# Altium project Module_Power_3V3Buck.PrjPcb
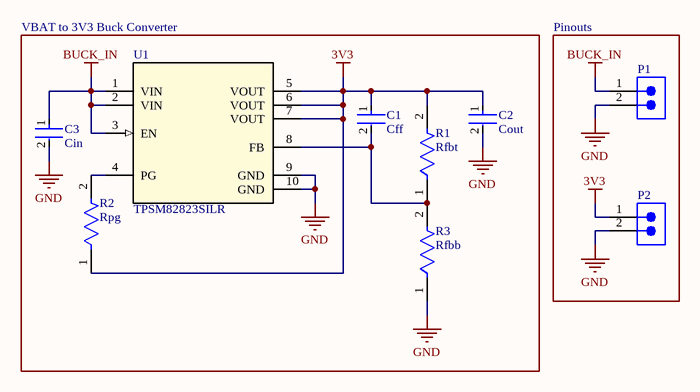
[diagram p0: Schematic.SchDoc]
1 sheet, 9 parts. Net scope: global (net labels, ports and power ports of the same name join across sheets).
Board file: PCB.PcbDoc

## Sheet Schematic.SchDoc
size A; SheetNumber: 1; SheetTotal: 1

### Parts
C1  Cff  [FP-GRM033-0_03-IPC_A]
C2  Cout  [FP-C0805C-DG-MFG]
C3  Cin  [FP-GRM188-0_1-e0_2_0_55-IPC_A]
P1  61300211121  [61300211121]  (value not drawn)
P2  61300211121  [61300211121]  (value not drawn)
R1  Rfbt  [FP-CRCW0402-e3-MFG]
R2  Rpg  [FP-CRCW0402-e3-IPC_C]
R3  Rfbb  [FP-CRCW0402-e3-IPC_C]
U1  TPSM82823SILR  [SIL0010D-MFG]

### Blocks framed on the sheet
VBAT to 3V3 Buck Converter: C1-C3 R1-R3 U1
Pinouts: P1 P2

### Nets
3V3: C1.1 C2.1 P2.1 R1.2 R2.1 U1.5(VOUT) U1.6(VOUT) U1.7(VOUT)
BUCK_IN: C3.1 P1.1 U1.1(VIN) U1.2(VIN) U1.3(EN)
GND: C2.2 C3.2 P1.2 P2.2 R3.1 U1.9(GND) U1.10(GND)
NetC1_2: C1.2 R1.1 R3.2 U1.8(FB)
NetR2_2: R2.2 U1.4(PG)

### Library data of the parts
C1 = CMP-2010-01296-2: Chip Multilayer Ceramic Capacitors for General Purpose, 0201, 120pF, X7R, 15%, 10%, 25V; Thickness: 0.013inch; Packaging: Tape and Reel; Dielectric: X7R; Series: GRM; Mount: Surface Mount; Height: 0.3mm; Voltage Rating (DC): 25V; Case/Package: 0201; Case Code (Metric): 0603; Case Code (Imperial): 0201; Min Operating Temperature: -55°C; Lead Free: Lead Free; Capacitance: 120pF; Width: 0.012inch; Package Quantity: 1; Voltage Rating: 25V; Termination: SMD/SMT; Radiation Hardening: No; Tolerance: 10%; Length: 0.6mm; Max Operating Temperature: 125°C; Depth: 0.3mm; Construction: Flat
C2 = CMP-2007-03243-2: CAP CER 10UF 10V X5R 0805; Manufacturer Part Number: C0805C106K8PACTU; Manufacturer: Kemet; 3DS Part Number: 220-00001; Tolerance: 10%; Temperature Coefficient: 15%; Material: Ceramic; Device Class L2: Capacitors; Device Class L1: Passive Components; ComponentLink2URL: https://content.kemet.com/datasheets/KEM_C1006_X5R_SMD.pdf; Height: 1.4mm; Lead Free: Yes; Digikey Description: CAP CER 10UF 10V X5R 0805; Octopart: https://octopart.com/c0805c106k8pactu-kemet-98697; Capacitance: 10uF; Value: 10uF; Temperature Range Low: -55°C; Temperature: -55°C to +85°C; Automotive: No; Mouser Description: CAP CER 10UF 10V X5R 0805; Ipc Land Pattern Name: CAPC200125X125; Temperature Range High: +85°C; Voltage: 10V; RoHS: TRUE; Device Class L3: Ceramic Capacitors; ComponentLink2Description: Datasheet; Voltage Rating: 10V; Package: C0805C-DG; Temperature Characteristic: X5R; Category: Cap
C3 = CMP-2006-02792-2: Chip Multilayer Ceramic Capacitors for General Purpose, 0603, 10uF, X5R, 15%, 20%, 6.3V; Packaging: Tape and Reel; Voltage Rating (DC): 6.3V; Width: 0.031inch; Termination: SMD/SMT; Dielectric: X5R; Package Quantity: 4000; Voltage Rating: 6.3V; Capacitance: 10uF; Case/Package: 0603; Min Operating Temperature: -55°C; Voltage: 6.3V; Length: 1.6mm; Thickness: 0.035inch; Lead Free: Lead Free; Depth: 0.8mm; Case Code (Imperial): 0603; Max Operating Temperature: 85°C; Material: Ceramic; Height: 0.8mm; Tolerance: 20%; Mount: Surface Mount; REACH SVHC: No SVHC; Radiation Hardening: No; Case Code (Metric): 1608
P1 P2 = CMP-1712-00002-6: NexarPartId: 20081794; Number of Contacts: 2; Pitch: 2.54mm; Connector Type: Male Pin; Voltage Rating: 250V; Current Rating: 3A; Gender: Male; Contact Resistance: 20mΩ; Height: 8.94mm; Lead Free: Lead Free; Number of Pins: 2; Termination: Through Hole; RoHS: Compliant; Lead Pitch: 2.54mm; REACH SVHC: No SVHC; Housing Material: PBT; Contact Mating Length: 5.9944mm; Min Operating Temperature: -40°C; Orientation: Vertical; Contact Material: Copper; Contact Gender: Male; Max Operating Temperature: 125°C; Number of Rows: 1; Number of Positions: 2; Packaging: Bulk; Contact Plating: Gold; Mount: Through Hole; Color: Black; Operating Supply Voltage: 250V
R1 = CMP-2002-00012-2: RES Thick Film, 453kΩ, 1%, 0.063W, 100ppm/°C, 0402; Resistance: 453kR; Voltage Rating (DC): 50V; Power Rating: 63mW; Features: Automotive AEC-Q200; Termination: SMD/SMT; Weight: 2.3E-05oz; Resistor Type: Thick Film; Size Code: 0402; Height: 0.016inch; RoHS Compliant: Yes; Resistance Tolerance: 1%; Construction: Rectangular; Radiation Hardening: No; Temperature Coefficient: 100ppm/°C; Series: CRCW; Depth: 0.5mm; Lead Free: Lead Free; Min Operating Temperature: -55°C; Package Quantity: 10; Length: 1mm; Case Code (Metric): 1005; Tolerance: 1%; Max Operating Temperature: 155°C; Voltage Rating: 50V; Packaging: Tape and Reel; Number of Pins: 2; Case Code (Imperial): 0402; Case/Package: 0402; Number of Terminations: 2; Contact Plating: Tin; Military Standard: Not; Max Power Dissipation: 63mW; Width: 0.5mm
R2 R3 = CMP-2002-08123-3: RES Thick Film, 100kΩ, 1%, 0.063W, 100ppm/°C, 0402; Power Rating: 63mW; Resistance: 100kR; Voltage Rating (DC): 50V; Lead Free: Lead Free; Height: 0.35mm; Contact Plating: Tin; Min Operating Temperature: -55°C; Package Quantity: 10000; Case/Package: 0402; Temperature Coefficient: 100ppm/°C; Number of Terminations: 2; Packaging: Tape and Reel; Max Power Dissipation: 63mW; Case Code (Metric): 1005; Mount: Surface Mount; Width: 0.02inch; Termination: SMD/SMT; Length: 1mm; Number of Pins: 2; Weight: 2.3E-05oz; Radiation Hardening: No; Tolerance: 1%; Military Standard: Not; Features: Automotive AEC-Q200; Depth: 0.5mm; Composition: Thick Film; Max Operating Temperature: 155°C; Voltage Rating: 50V; Case Code (Imperial): 0402
U1 = TPSM82823SILR: No Description Available; Mfr_Name: Texas Instruments; TYPE: TYPE; RefDes: RefDes